# EAGLE design GRBL Shield (EAGLE 6.5.0)
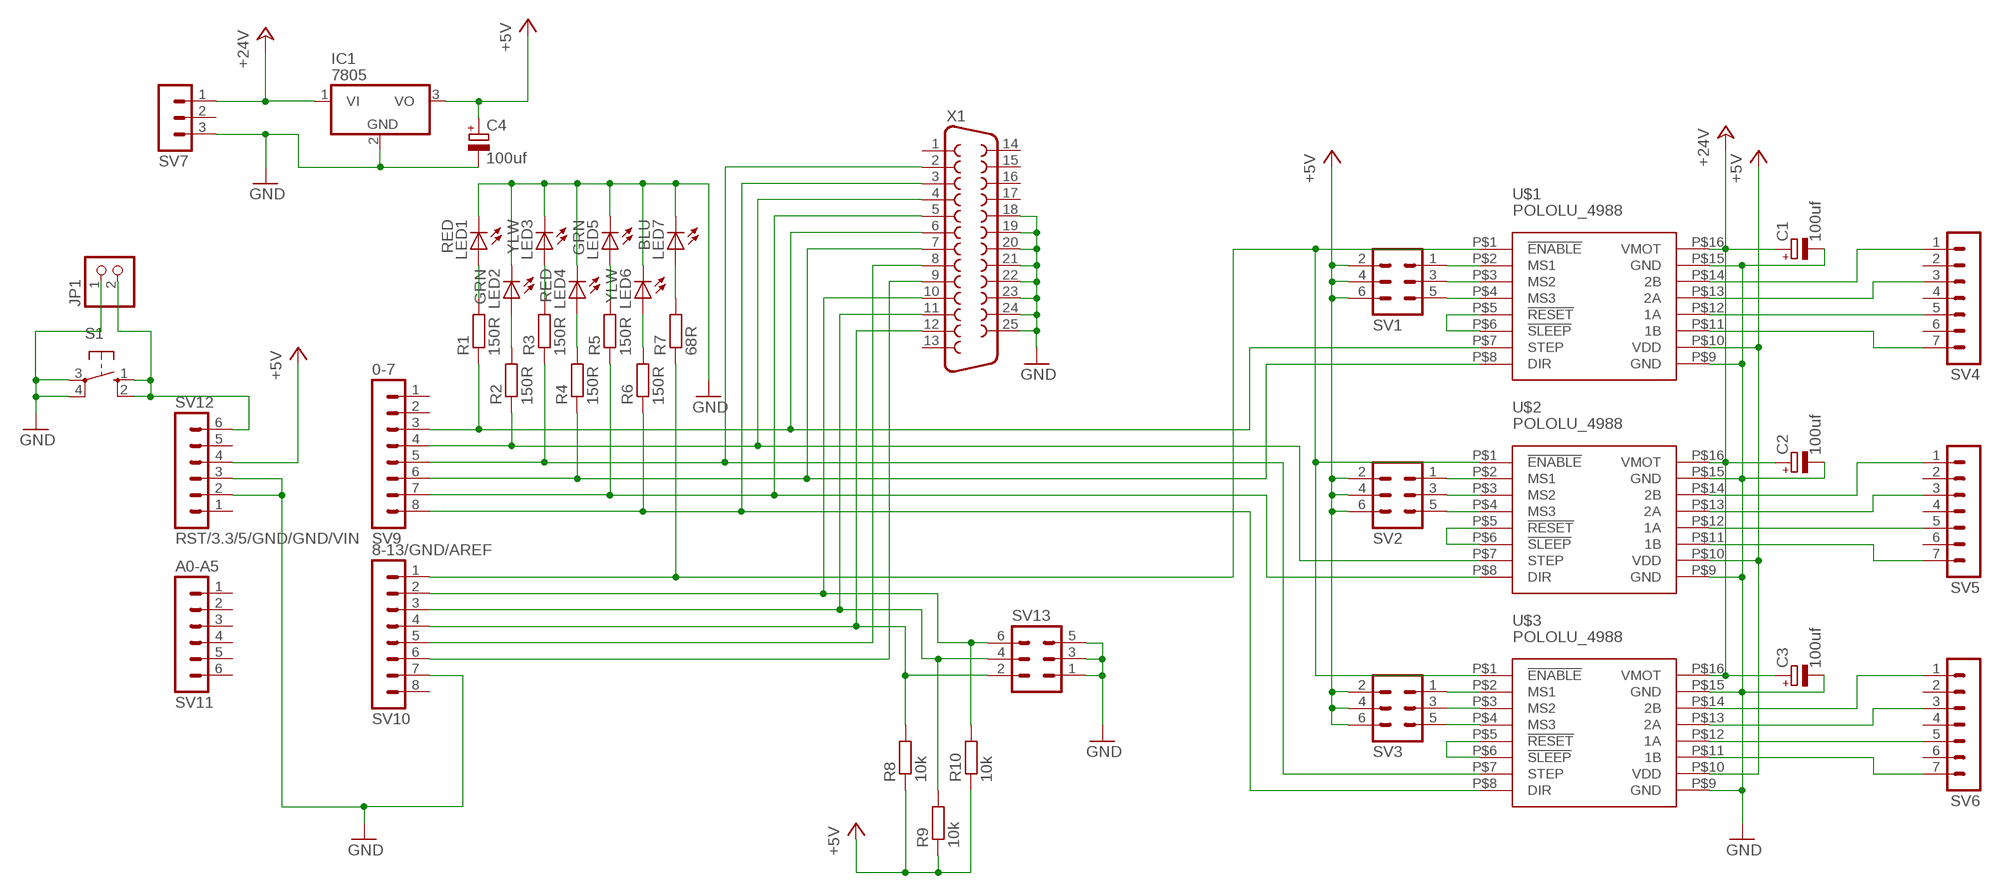
[diagram p0: schematic, sheet 1]

## Parts
C1  100uf  CPOL-EUE2.5-7  [E2,5-7]
C2  100uf  CPOL-EUE2.5-7  [E2,5-7]
C3  100uf  CPOL-EUE2.5-7  [E2,5-7]
C4  100uf  CPOL-EUE2.5-7  [E2,5-7]
IC1  7805  786TV  [TO220V]
JP1  PINHD-1X2  [1X02]
LED1  RED  LED5MM  [LED5MM]
LED2  GRN  LED5MM  [LED5MM]
LED3  YLW  LED5MM  [LED5MM]
LED4  RED  LED5MM  [LED5MM]
LED5  GRN  LED5MM  [LED5MM]
LED6  YLW  LED5MM  [LED5MM]
LED7  BLU  LED5MM  [LED5MM]
R1  150R  R-EU_0207/2V  [0207/2V]
R2  150R  R-EU_0207/2V  [0207/2V]
R3  150R  R-EU_0207/2V  [0207/2V]
R4  150R  R-EU_0207/2V  [0207/2V]
R5  150R  R-EU_0207/2V  [0207/2V]
R6  150R  R-EU_0207/2V  [0207/2V]
R7  68R  R-EU_0207/2V  [0207/2V]
R8  10k  R-EU_0204/7  [0204/7]
R9  10k  R-EU_0204/7  [0204/7]
R10  10k  R-EU_0204/7  [0204/7]
S1  10-XX  [B3F-10XX]
SV1  MA03-2  [MA03-2]
SV2  MA03-2  [MA03-2]
SV3  MA03-2  [MA03-2]
SV4  MA07-1  [MA07-1]
SV5  MA07-1  [MA07-1]
SV6  MA07-1  [MA07-1]
SV7  MA03-1  [MA03-1]
SV9  0-7  MA08-1  [MA08-1]
SV10  8-13/GND/AREF  MA08-1  [MA08-1]
SV11  A0-A5  MA06-1  [MA06-1]
SV12  RST/3.3/5/GND/GND/VIN  MA06-1  [MA06-1]
SV13  MA03-2  [MA03-2]
U$1  POLOLU_4988  [POLOLU_4988]
U$2  POLOLU_4988  [POLOLU_4988]
U$3  POLOLU_4988  [POLOLU_4988]
X1  F25H  [F25H]

## Nets
+5V: C4.+ IC1.3(VO) R8.1 R9.1 R10.1 SV1.2 SV1.4 SV1.6 SV2.2 SV2.4 SV2.6 SV3.2 SV3.4 SV3.6 SV12.4 U$1.P$10(VDD) U$2.P$10(VDD) U$3.P$10(VDD)
+24V: C1.+ C2.+ C3.+ IC1.1(VI) SV7.1 U$1.P$16(VMOT) U$2.P$16(VMOT) U$3.P$16(VMOT)
D2: R1.1 SV9.3 U$1.P$7(STEP) X1.6
D3: R2.1 SV9.4 U$2.P$7(STEP) X1.4
D4: R3.1 SV9.5 U$3.P$7(STEP) X1.2
D5: R4.1 SV9.6 U$1.P$8(DIR) X1.7
D6: R5.1 SV9.7 U$2.P$8(DIR) X1.5
D7: R6.1 SV9.8 U$3.P$8(DIR) X1.3
D8: R7.1 SV10.1 U$1.P$1(!ENABLE) U$2.P$1(!ENABLE) U$3.P$1(!ENABLE)
D9: R10.2 SV10.2 SV13.6 X1.10
D10: R9.2 SV10.3 SV13.4 X1.11
D11: R8.2 SV10.4 SV13.2 X1.12
D12: SV10.5 X1.8
D13: SV10.6 X1.9
GND: C1.- C2.- C3.- C4.- IC1.2(GND) JP1.1 LED1.K(C) LED2.K(C) LED3.K(C) LED4.K(C) LED5.K(C) LED6.K(C) LED7.K(C) S1.3(P) S1.4(P1) SV7.3 SV10.7 SV12.2 SV12.3 SV13.1 SV13.3 SV13.5 U$1.P$9(GND) U$1.P$15(GND) U$2.P$9(GND) U$2.P$15(GND) U$3.P$9(GND) U$3.P$15(GND) X1.18 X1.19 X1.20 X1.21 X1.22 X1.23 X1.24 X1.25
N$7: U$1.P$5(!RESET) U$1.P$6(!SLEEP)
N$8: U$2.P$5(!RESET) U$2.P$6(!SLEEP)
N$9: U$3.P$5(!RESET) U$3.P$6(!SLEEP)
N$11: SV1.1 U$1.P$2(MS1)
N$12: SV1.3 U$1.P$3(MS2)
N$13: SV1.5 U$1.P$4(MS3)
N$14: SV2.1 U$2.P$2(MS1)
N$15: SV2.3 U$2.P$3(MS2)
N$16: SV2.5 U$2.P$4(MS3)
N$17: SV3.1 U$3.P$2(MS1)
N$18: SV3.3 U$3.P$3(MS2)
N$19: SV3.5 U$3.P$4(MS3)
N$22: SV4.1 U$1.P$14(2B)
N$23: SV4.3 U$1.P$13(2A)
N$24: SV4.5 U$1.P$12(1A)
N$25: SV4.7 U$1.P$11(1B)
N$26: SV5.1 U$2.P$14(2B)
N$27: SV5.3 U$2.P$13(2A)
N$28: SV5.5 U$2.P$12(1A)
N$29: SV5.7 U$2.P$11(1B)
N$30: SV6.1 U$3.P$14(2B)
N$31: SV6.3 U$3.P$13(2A)
N$32: SV6.5 U$3.P$12(1A)
N$33: SV6.7 U$3.P$11(1B)
N$39: LED1.A R1.2
N$40: LED2.A R2.2
N$41: LED3.A R3.2
N$42: LED4.A R4.2
N$43: LED5.A R5.2
N$44: LED6.A R6.2
N$46: LED7.A R7.2
RESET: JP1.2 S1.1(S) S1.2(S1) SV12.6
Unconnected: SV4.2 SV4.4 SV4.6 SV5.2 SV5.4 SV5.6 SV6.2 SV6.4 SV6.6 SV7.2 SV9.1 SV9.2 SV10.8 SV11.1 SV11.2 SV11.3 SV11.4 SV11.5 SV11.6 SV12.1 SV12.5 X1.1 X1.13 X1.14 X1.15 X1.16 X1.17

## Library data of the parts
C1-C4 = rcl:CPOL-EU: POLARIZED CAPACITOR, European symbol
IC1 = linear:78*: Positive VOLTAGE REGULATOR Source: http://cache.national.com/ds/LM/LM78L05.pdf http://www.fairchildsemi.com/ds/LM/LM7805.pdf
JP1 = pinhead:PINHD-1X2: PIN HEADER
LED1-LED7 = led:LED: LED OSRAM: - CHIPLED LG R971, LG N971, LY N971, LG Q971, LY Q971, LO R971, LY R971 LH N974, LH R974 LS Q976, LO Q976, LY Q976 LO Q996 - Hyper CHIPLED LW Q18S LB Q993, LB Q99A, LB R99A - SideLED LS A670, LO A670, LY A670, LG A670, LP A670 LB A673, LV A673, LT A673, LW A673 LH A674 LY A675 LS A676, LA A676, LO A676, LY A676, LW A676 LS A679, LY A679, LG A679 - Hyper Micro SIDELED® LS Y876, LA Y876, LO Y876, LY Y876 LT Y87S - SmartLED LW L88C, LW L88S LB L89C, LB L89S, LG L890 LS L89K, LO L89K, LY L89K LS L896, LA L896, LO L896, LY L896 - TOPLED LS T670, LO T670, LY T670, LG T670, LP T670 LSG T670, LSP T670, LSY T670, LOP T670, LYG T670 LG T671, LOG T671, LSG T671 LB T673, LV T673, LT T673, LW T673 LH T674 LS T676, LA T676, LO T676, LY T676, LB T676, LH T676, LSB T676, LW T676 LB T67C, LV T67C, LT T67C, LS T67K, LO T67K, LY T67K, LW E67C LS E67B, LA E67B, LO E67B, LY E67B, LB E67C, LV E67C, LT E67C LW T67C LS T679, LY T679, LG T679 LS T770, LO T770, LY T770, LG T770, LP T770 LB T773, LV T773, LT T773, LW T773 LH T774 LS E675, LA E675, LY E675, LS T675 LS T776, LA T776, LO T776, LY T776, LB T776 LHGB T686 LT T68C, LB T68C - Hyper Mini TOPLED® LB M676 - Mini TOPLED Santana® LG M470 LS M47K, LO M47K, LY M47K Source: http://www.osram.convergy.de LUXEON: - LUMILED® LXK2-PW12-R00, LXK2-PW12-S00, LXK2-PW14-U00, LXK2-PW14-V00 LXK2-PM12-R00, LXK2-PM12-S00, LXK2-PM14-U00 LXK2-PE12-Q00, LXK2-PE12-R00, LXK2-PE12-S00, LXK2-PE14-T00, LXK2-PE14-U00 LXK2-PB12-K00, LXK2-PB12-L00, LXK2-PB12-M00, LXK2-PB14-N00, LXK2-PB14-P00, LXK2-PB14-Q00 LXK2-PR12-L00, LXK2-PR12-M00, LXK2-PR14-Q00, LXK2-PR14-R00 LXK2-PD12-Q00, LXK2-PD12-R00, LXK2-PD12-S00 LXK2-PH12-R00, LXK2-PH12-S00 LXK2-PL12-P00, LXK2-PL12-Q00, LXK2-PL12-R00 Source: www.luxeon.com KINGBRIGHT: KA-3528ASYC Source: www.kingbright.com
R1-R10 = rcl:R-EU_: RESISTOR, European symbol
S1 = switch-omron:10-XX: OMRON SWITCH; MPN: B3F-1000; OC_FARNELL: 176432; OC_NEWARK: 36M3542
SV1-SV3 SV13 = con-lstb:MA03-2: PIN HEADER; OC_FARNELL: unknown; OC_NEWARK: unknown
SV4-SV6 = con-lstb:MA07-1: PIN HEADER; OC_FARNELL: unknown; OC_NEWARK: unknown
SV7 = con-lstb:MA03-1: PIN HEADER; OC_FARNELL: unknown; OC_NEWARK: unknown
SV9 SV10 = con-lstb:MA08-1: PIN HEADER; OC_FARNELL: unknown; OC_NEWARK: unknown
SV11 SV12 = con-lstb:MA06-1: PIN HEADER; OC_FARNELL: unknown; OC_NEWARK: unknown
U$1-U$3 = pololu:POLOLU_4988
X1 = con-subd:F25: SUB-D; OC_FARNELL: unknown; OC_NEWARK: unknown

## Board
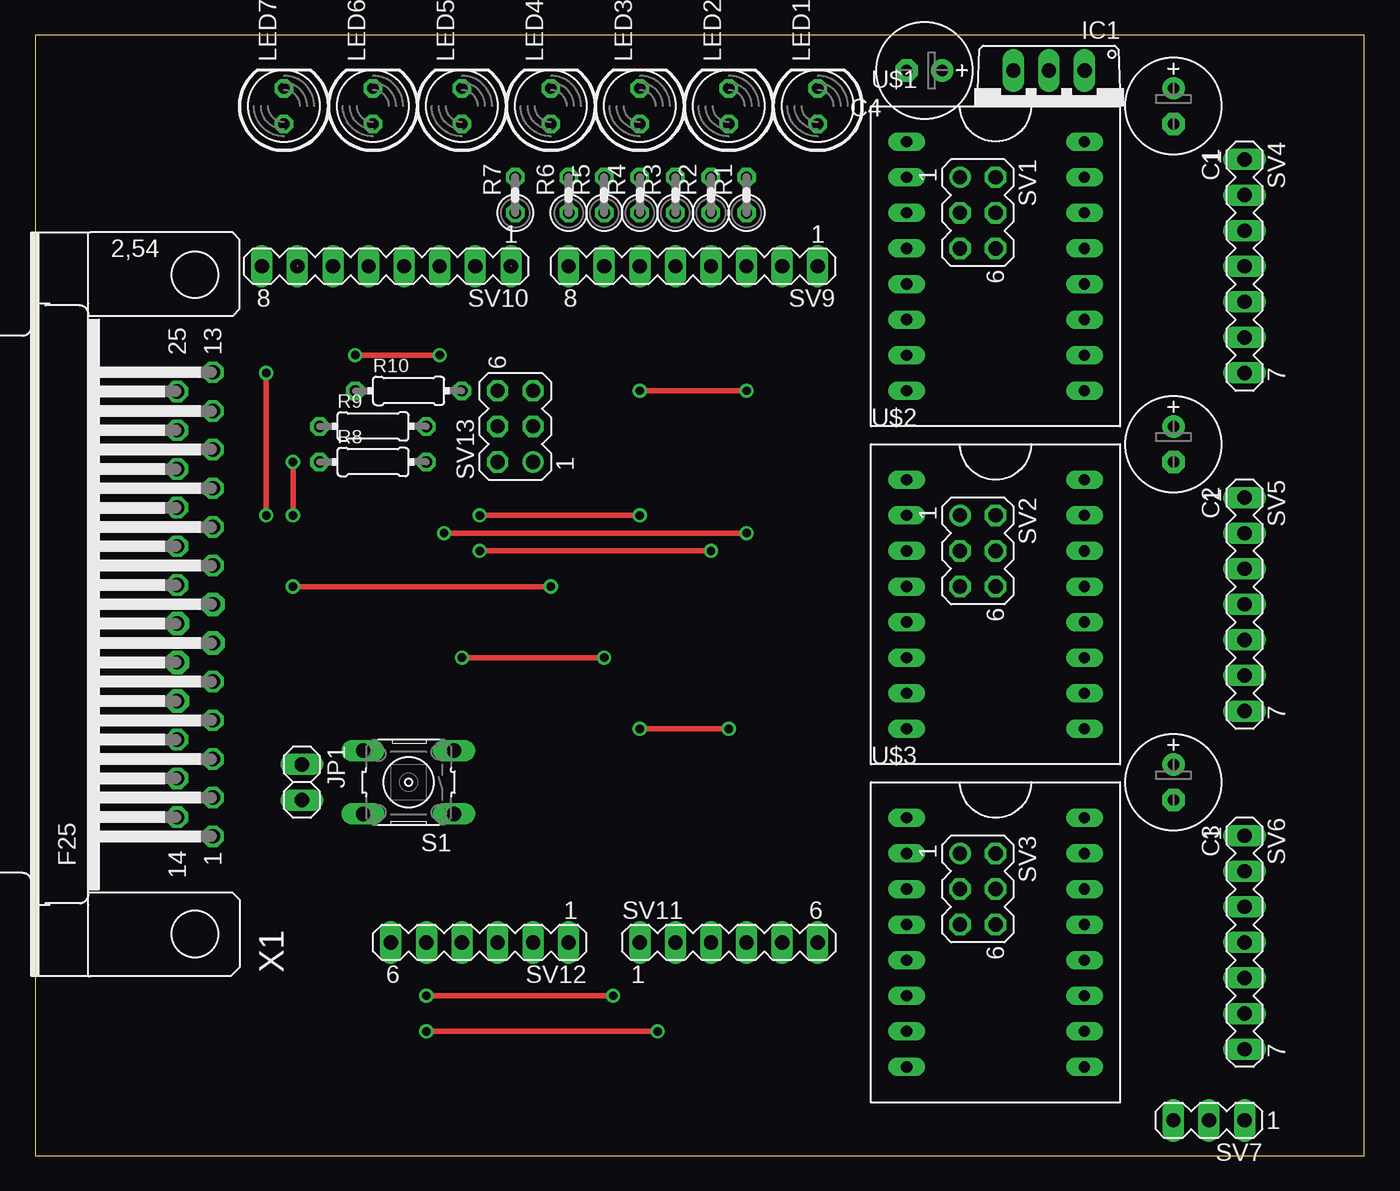
[diagram p1: board, top side]
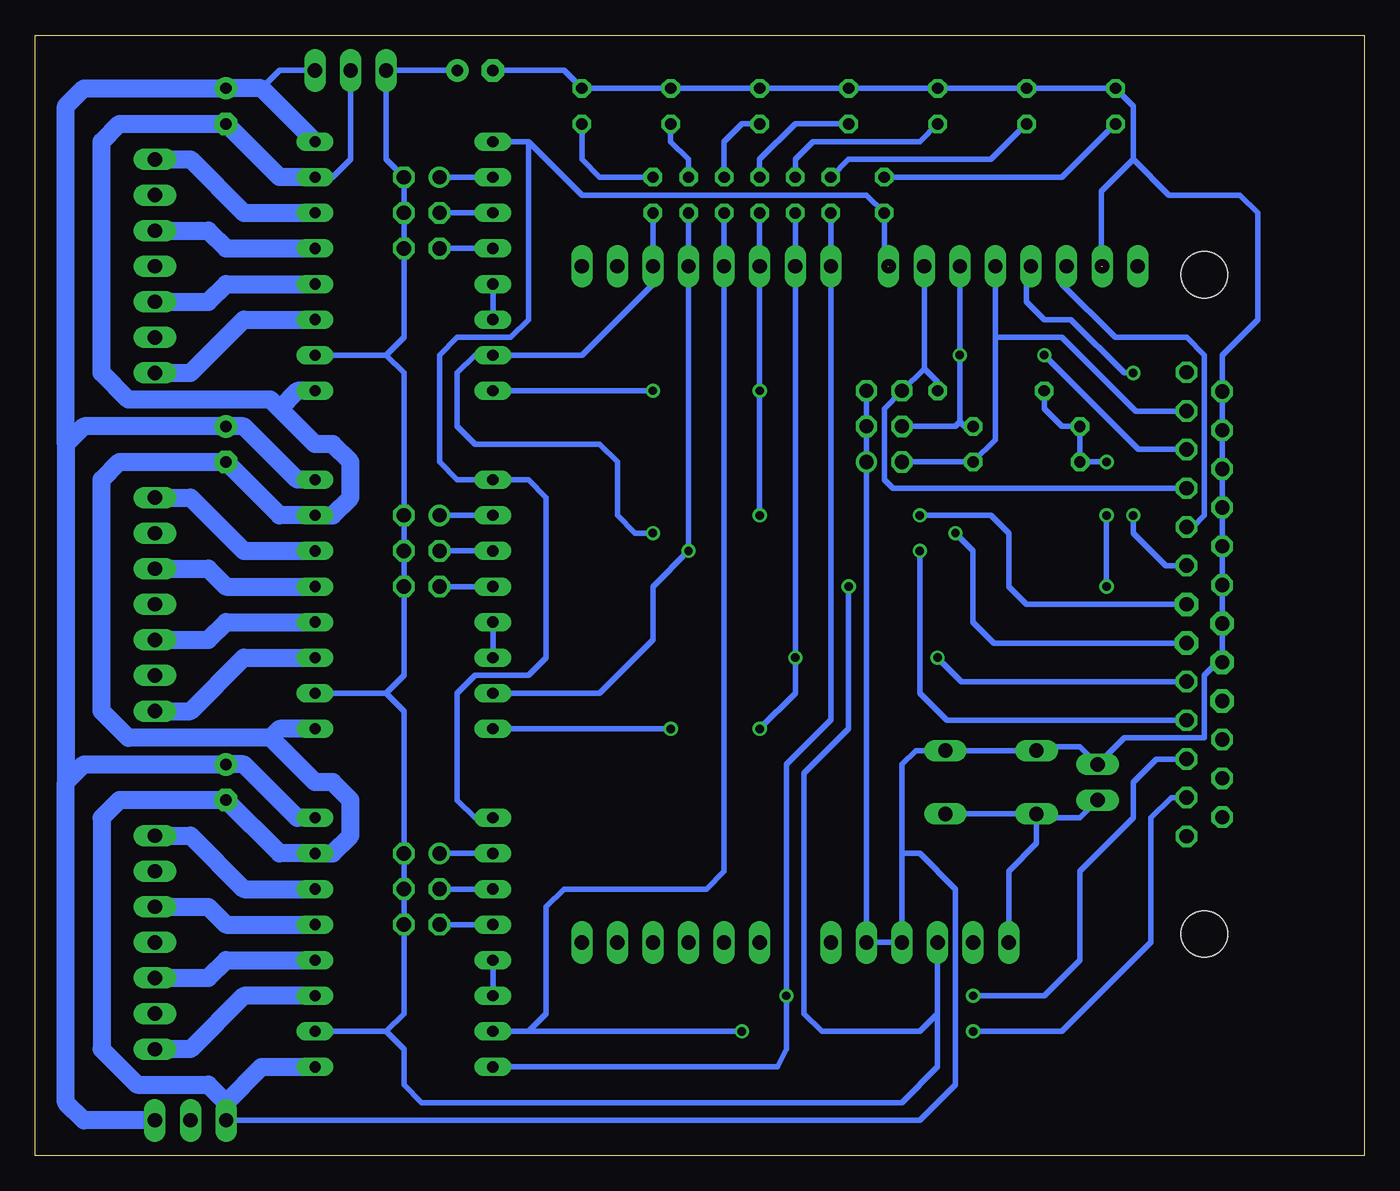
[diagram p2: board, bottom side, seen from below]

Size 94.92 x 80 mm. Coordinates in mm from the lower left corner, seen from the top.
Outline: 0,0 94.92,0 94.92,80 0,80 0,0
Copper layers (1*16): Top 0.035mm / dielectric 1.5mm / Bottom 0.035mm
Design rules "default": minimum track width 10mil, minimum drill 24mil, track to track 8mil, track to pad 8mil, pad to pad 8mil, via to via 8mil, smd to smd 8mil, copper to edge 40mil, drill to drill 8mil, minimum pad ring 10mil, minimum via ring 8mil, stop-mask expansion 4mil, vias tented up to drill 0mil, thermal gap 10mil

### Footprints (pad centres in the part's own frame; a part is rotated, then mirrored left to right if it is on the bottom)
E2,5-7 = drill 0.813 pad 1.6: + -1.27,0 | drill 0.813 pad 1.6 octagon: - 1.27,0
TO220V = drill 1.016 long: 1 -2.54,-2.54; 2 0,-2.54; 3 2.54,-2.54
1X02 = drill 1.016 long: 1 -1.27,0; 2 1.27,0
LED5MM = drill 0.813 octagon: A -1.27,0; K 1.27,0
0207/2V = drill 0.813 octagon: 1 -1.27,0; 2 1.27,0
0204/7 = drill 0.813 octagon: 1 -3.81,0; 2 3.81,0
B3F-10XX = drill 1.016 long: 1 -3.251,2.261; 2 3.251,2.261; 3 -3.251,-2.261; 4 3.251,-2.261
MA03-2 = drill 1.016: 1 -2.54,-1.27 | drill 1.016 octagon: 2 -2.54,1.27; 3 0,-1.27; 4 0,1.27; 5 2.54,-1.27; 6 2.54,1.27
MA07-1 = drill 1.016 long: 1 -7.62,0; 2 -5.08,0; 3 -2.54,0; 4 0,0; 5 2.54,0; 6 5.08,0; 7 7.62,0
MA03-1 = drill 1.016 long: 1 -2.54,0; 2 0,0; 3 2.54,0
MA08-1 = drill 1.016 long: 1 -8.89,0; 2 -6.35,0; 3 -3.81,0; 4 -1.27,0; 5 1.27,0; 6 3.81,0; 7 6.35,0; 8 8.89,0
MA06-1 = drill 1.016 long: 1 -6.35,0; 2 -3.81,0; 3 -1.27,0; 4 1.27,0; 5 3.81,0; 6 6.35,0
POLOLU_4988 = drill 0.8 long: P$1 -6.35,8.89; P$2 -6.35,6.35; P$3 -6.35,3.81; P$4 -6.35,1.27; P$5 -6.35,-1.27; P$6 -6.35,-3.81; P$7 -6.35,-6.35; P$8 -6.35,-8.89; P$9 6.35,-8.89; P$10 6.35,-6.35; P$11 6.35,-3.81; P$12 6.35,-1.27; P$13 6.35,1.27; P$14 6.35,3.81; P$15 6.35,6.35; P$16 6.35,8.89
F25H = drill 1.016 octagon: 1 -16.561,-1.27; 2 -13.792,-1.27; 3 -11.049,-1.27; 4 -8.28,-1.27; 5 -5.512,-1.27; 8 2.769,-1.27; 9 5.512,-1.27; 10 8.28,-1.27; 11 11.049,-1.27; 12 13.792,-1.27; 13 16.561,-1.27; 14 -15.189,1.27; 15 -12.421,1.27; 16 -9.652,1.27; 20 1.372,1.27; 21 4.14,1.27; 22 6.909,1.27; 23 9.652,1.27; 24 12.421,1.27; 25 15.189,1.27 | drill 1.016 pad 1.67 octagon: 6 -2.769,-1.27; 7 0,-1.27; 17 -6.909,1.27; 18 -4.14,1.27; 19 -1.372,1.27 | hole 3.302: -23.52,0; 23.52,0

### Placement (x,y rotation side)
C1  81.28,74.93 270 top
C2  81.28,50.8 270 top
C3  81.28,26.67 270 top
C4  63.5,77.47 180 top
IC1  72.39,74.93 180 top
JP1  19.05,26.67 270 top
LED1  55.88,74.93 90 top
LED2  49.53,74.93 90 top
LED3  43.18,74.93 90 top
LED4  36.83,74.93 90 top
LED5  30.48,74.93 90 top
LED6  24.13,74.93 90 top
LED7  17.78,74.93 90 top
R1  50.8,68.58 90 top
R2  48.26,68.58 90 top
R3  45.72,68.58 90 top
R4  43.18,68.58 90 top
R5  40.64,68.58 90 top
R6  38.1,68.58 90 top
R7  34.29,68.58 90 top
R8  24.13,49.53 0 top
R9  24.13,52.07 0 top
R10  26.67,54.61 0 top
S1  26.67,26.67 180 top
SV1  67.31,67.31 270 top
SV2  67.31,43.18 270 top
SV3  67.31,19.05 270 top
SV4  86.36,63.5 270 top
SV5  86.36,39.37 270 top
SV6  86.36,15.24 270 top
SV7  83.82,2.54 180 top
SV9  46.99,63.5 180 top
SV10  25.08,63.5 180 top
SV11  49.53,15.24 0 top
SV12  31.75,15.24 180 top
SV13  34.29,52.07 90 top
U$1  68.58,63.5 0 top
U$2  68.58,39.37 0 top
U$3  68.58,15.24 0 top
X1  11.43,39.37 90 top

### Tracks (layer width: path | path; a pad name or v marks a point on that pad's centre or on a via)
+5V  (via drill 0.6 pad 1.02)
  Top 0.406: v36.83,40.64 v18.41,40.64 | v18.41,45.72 v18.41,49.53
  Bottom 0.406: 69.85,57.15 68.58,58.42 SV1.6 SV1.4 SV1.2 69.85,71.12 IC1.3 C4.+ | 69.85,57.15 U$1.P$10 | 69.85,57.15 68.58,55.88 SV2.2 SV2.4 SV2.6 68.58,34.29 69.85,33.02 | 69.85,8.89 68.58,10.16 SV3.6 SV3.4 SV3.2 68.58,31.75 69.85,33.02 | 69.85,8.89 U$3.P$10 | 69.85,33.02 U$2.P$10 | 30.48,10.16 30.48,6.35 33.02,3.81 67.31,3.81 68.58,5.08 68.58,7.62 69.85,8.89 | R10.1 22.86,53.34 21.59,52.07 R9.1 R8.1 v18.41,49.53 | SV12.4 30.48,10.16 | 30.48,10.16 31.75,8.89 38.73,8.89 40.01,10.16 40.01,27.3 36.83,30.48 v36.83,40.64 | v18.41,40.64 v18.41,45.72
+24V
  Bottom 0.406: IC1.1 77.47,77.47 78.74,76.2
  Bottom 1.27: U$3.P$16 76.2,24.13 80.01,27.94 C3.+ 91.44,27.94 92.71,26.67 | U$2.P$16 76.2,48.26 80.01,52.07 C2.+ 91.44,52.07 92.71,50.8 | U$1.P$16 78.74,76.2 C1.+ 91.44,76.2 92.71,74.93 92.71,50.8 | SV7.1 91.44,2.54 92.71,3.81 92.71,26.67 | 92.71,50.8 92.71,26.67
D2  (via drill 0.6)
  Top 0.406: v29.21,44.45 v50.8,44.45
  Bottom 0.406: R1.1 SV9.3 50.8,62.23 55.88,57.15 U$1.P$7 63.5,57.15 64.77,55.88 64.77,52.07 63.5,50.8 54.61,50.8 53.34,49.53 53.34,45.72 52.07,44.45 v50.8,44.45 | X1.6 26.44,36.6 27.94,38.1 27.94,43.18 v29.21,44.45
D3  (via drill 0.6)
  Top 0.406: v31.75,43.18 v48.26,43.18
  Bottom 0.406: R2.1 SV9.4 v48.26,43.18 50.8,40.64 50.8,36.83 54.61,33.02 U$2.P$7 | X1.4 29.82,31.09 31.75,33.02 v31.75,43.18
D4  (via drill 0.6)
  Top 0.406: v27.94,8.89 v44.45,8.89
  Bottom 0.406: R3.1 SV9.5 45.72,20.32 46.99,19.05 57.15,19.05 58.42,17.78 58.42,10.16 59.69,8.89 | 59.69,8.89 U$3.P$7 | X1.2 13.79,25.58 15.24,24.13 15.24,15.24 21.59,8.89 v27.94,8.89 | v44.45,8.89 59.69,8.89
D5  (via drill 0.6, 0.6 pad 1.02)
  Top 0.406: v43.18,54.61 v50.8,54.61 | v31.75,45.72 v43.18,45.72
  Bottom 0.406: R4.1 SV9.6 v43.18,54.61 v43.18,45.72 | v50.8,54.61 U$1.P$8 | X1.7 24.13,39.37 25.4,40.64 25.4,44.45 26.67,45.72 v31.75,45.72
D6  (via drill 0.6, 0.6 pad 1.02)
  Top 0.406: v43.18,30.48 v49.53,30.48 | v30.48,35.56 v40.64,35.56
  Bottom 0.406: R5.1 SV9.7 v40.64,35.56 40.64,33.02 v43.18,30.48 | v49.53,30.48 U$2.P$8 | X1.5 28.78,33.86 v30.48,35.56
D7  (via drill 0.6)
  Top 0.406: v27.94,11.43 v41.27,11.43
  Bottom 0.406: R6.1 SV9.8 38.1,31.11 41.27,27.94 v41.27,11.43 41.27,7.62 41.91,6.35 U$3.P$8 | X1.3 14.86,28.32 16.51,26.67 16.51,24.13 20.32,20.32 20.32,13.97 22.86,11.43 v27.94,11.43
D8  (1 unrouted)
  Bottom 0.406: 34.04,63.5 34.29,63.75 R7.1 35.56,68.58 55.88,68.58 59.69,72.39 | U$1.P$1 59.69,72.39 | 59.69,72.39 59.69,59.69 60.96,58.42 64.77,58.42 66.04,57.15 66.04,49.53 64.77,48.26 U$2.P$1 59.69,48.26 58.42,46.99 58.42,35.56 59.69,34.29 63.5,34.29 64.77,33.02 64.77,25.4 63.5,24.13 U$3.P$1
D9
  Bottom 0.406: SV10.2 31.43,56.2 | 31.43,56.2 SV13.6 34.29,53.34 34.29,48.26 33.68,47.65 X1.10 | R10.2 30.48,55.24 31.43,56.2
D10  (via drill 0.6 pad 1.02)
  Top 0.406: v22.86,57.15 v28.89,57.15
  Bottom 0.406: SV10.3 v28.89,57.15 28.89,52.39 | 28.89,52.39 29.21,52.07 SV13.4 | R9.2 28.57,52.07 28.89,52.39 | X1.11 16.13,50.42 v22.86,57.15
D11
  Bottom 0.406: SV10.4 26.35,58.42 | 26.35,58.42 26.35,51.12 R8.2 SV13.2 | X1.12 16.33,53.16 21.59,58.42 26.35,58.42
D12  (via drill 0.6 pad 1.02)
  Top 0.406: v16.51,45.72 v16.51,55.88
  Bottom 0.406: X1.8 14.2,42.14 16.51,44.45 v16.51,45.72 | v16.51,55.88 17.14,55.88 20.95,59.69 22.86,59.69 24.13,60.96 24.13,63.18 SV10.5
D13
  Bottom 0.406: X1.9 12.27,44.88 11.43,45.72 11.43,57.15 12.7,58.42 17.78,58.42 21.59,62.23 SV10.6
GND  (1 unrouted)
  Bottom 0.406: 18.8,63.5 18.8,68.83 16.51,71.12 | 16.51,71.12 16.51,74.93 LED7.K LED6.K LED5.K LED4.K LED3.K LED2.K LED1.K 57.15,77.47 C4.- | 33.02,21.59 33.02,27.94 32.03,28.93 S1.3 S1.4 23.14,29.21 20.32,29.21 JP1.1 17.14,29.84 11.43,29.84 11.43,34.29 10.49,35.23 X1.18 X1.19 X1.20 X1.21 X1.22 X1.23 X1.24 X1.25 10.16,57.15 7.62,59.69 7.62,67.31 8.89,68.58 13.97,68.58 16.51,71.12 | 33.02,21.59 SV12.3 SV12.2 SV13.1 SV13.3 SV13.5 | IC1.2 72.39,71.12 73.66,69.85 U$1.P$15 | 33.02,21.59 31.75,21.59 29.21,19.05 29.21,5.08 31.75,2.54 SV7.3
  Bottom 1.27: U$1.P$15 77.47,69.85 C1.- 88.9,73.66 90.17,72.39 90.17,55.88 88.27,53.98 78.11,53.98 77.47,53.34 | 78.11,29.84 74.93,26.67 73.66,26.67 72.39,25.4 72.39,22.86 73.66,21.59 U$3.P$15 77.47,21.59 C3.- 88.9,25.4 90.17,24.13 90.17,7.62 87.63,5.08 82.55,5.08 81.28,3.81 | 78.11,29.84 88.27,29.84 90.17,31.75 90.17,48.26 88.9,49.53 C2.- 77.47,45.72 U$2.P$15 73.66,45.72 72.39,46.99 72.39,49.53 73.66,50.8 74.93,50.8 77.47,53.34 | U$1.P$9 76.2,54.61 77.47,53.34 | U$2.P$9 77.47,30.48 78.11,29.84 | 81.28,3.81 78.74,6.35 U$3.P$9 | 81.28,3.81 SV7.3
N$7
  Bottom 0.406: U$1.P$6 U$1.P$5
N$8
  Bottom 0.406: U$2.P$6 U$2.P$5
N$9
  Bottom 0.406: U$3.P$6 U$3.P$5
N$11
  Bottom 0.406: SV1.1 U$1.P$2
N$12
  Bottom 0.406: SV1.3 U$1.P$3
N$13
  Bottom 0.406: SV1.5 U$1.P$4
N$14
  Bottom 0.406: SV2.1 U$2.P$2
N$15
  Bottom 0.406: SV2.3 U$2.P$3
N$16
  Bottom 0.406: SV2.5 U$2.P$4
N$17
  Bottom 0.406: SV3.1 U$3.P$2
N$18
  Bottom 0.406: SV3.3 U$3.P$3
N$19
  Bottom 0.406: SV3.5 U$3.P$4
N$22
  Bottom 1.27: SV4.1 83.82,71.12 80.01,67.31 U$1.P$14
N$23
  Bottom 1.27: SV4.3 82.55,66.04 81.28,64.77 U$1.P$13
N$24
  Bottom 1.27: SV4.5 82.55,60.96 81.28,62.23 U$1.P$12
N$25
  Bottom 1.27: SV4.7 83.82,55.88 80.01,59.69 U$1.P$11
N$26
  Bottom 1.27: SV5.1 83.82,46.99 80.01,43.18 U$2.P$14
N$27
  Bottom 1.27: SV5.3 82.55,41.91 81.28,40.64 U$2.P$13
N$28
  Bottom 1.27: SV5.5 82.55,36.83 81.28,38.1 U$2.P$12
N$29
  Bottom 1.27: SV5.7 83.82,31.75 80.01,35.56 U$2.P$11
N$30
  Bottom 1.27: SV6.1 83.82,22.86 80.01,19.05 U$3.P$14
N$31
  Bottom 1.27: SV6.3 82.55,17.78 81.28,16.51 U$3.P$13
N$32
  Bottom 1.27: SV6.5 82.55,12.7 81.28,13.97 U$3.P$12
N$33
  Bottom 1.27: U$3.P$11 80.01,11.43 83.82,7.62 SV6.7
N$39
  Bottom 0.406: R1.2 54.61,69.85 55.88,71.12 LED1.A
N$40
  Bottom 0.406: R2.2 48.26,71.12 49.53,72.39 LED2.A
N$41
  Bottom 0.406: R3.2 45.72,72.39 44.45,73.66 LED3.A
N$42
  Bottom 0.406: R4.2 43.18,71.12 40.64,73.66 LED4.A
N$43
  Bottom 0.406: R5.2 40.64,71.12 39.37,72.39 31.75,72.39 LED5.A
N$44
  Bottom 0.406: R6.2 36.83,71.12 26.67,71.12 LED6.A
N$46
  Bottom 0.406: R7.2 21.59,69.85 LED7.A
RESET
  Bottom 0.406: S1.1 S1.2 | JP1.2 20.32,24.13 23.14,24.13 S1.2 | S1.2 23.42,22.3 25.4,20.32 SV12.6